# Altium project Microcontroller_sch_v22.PrjPcb
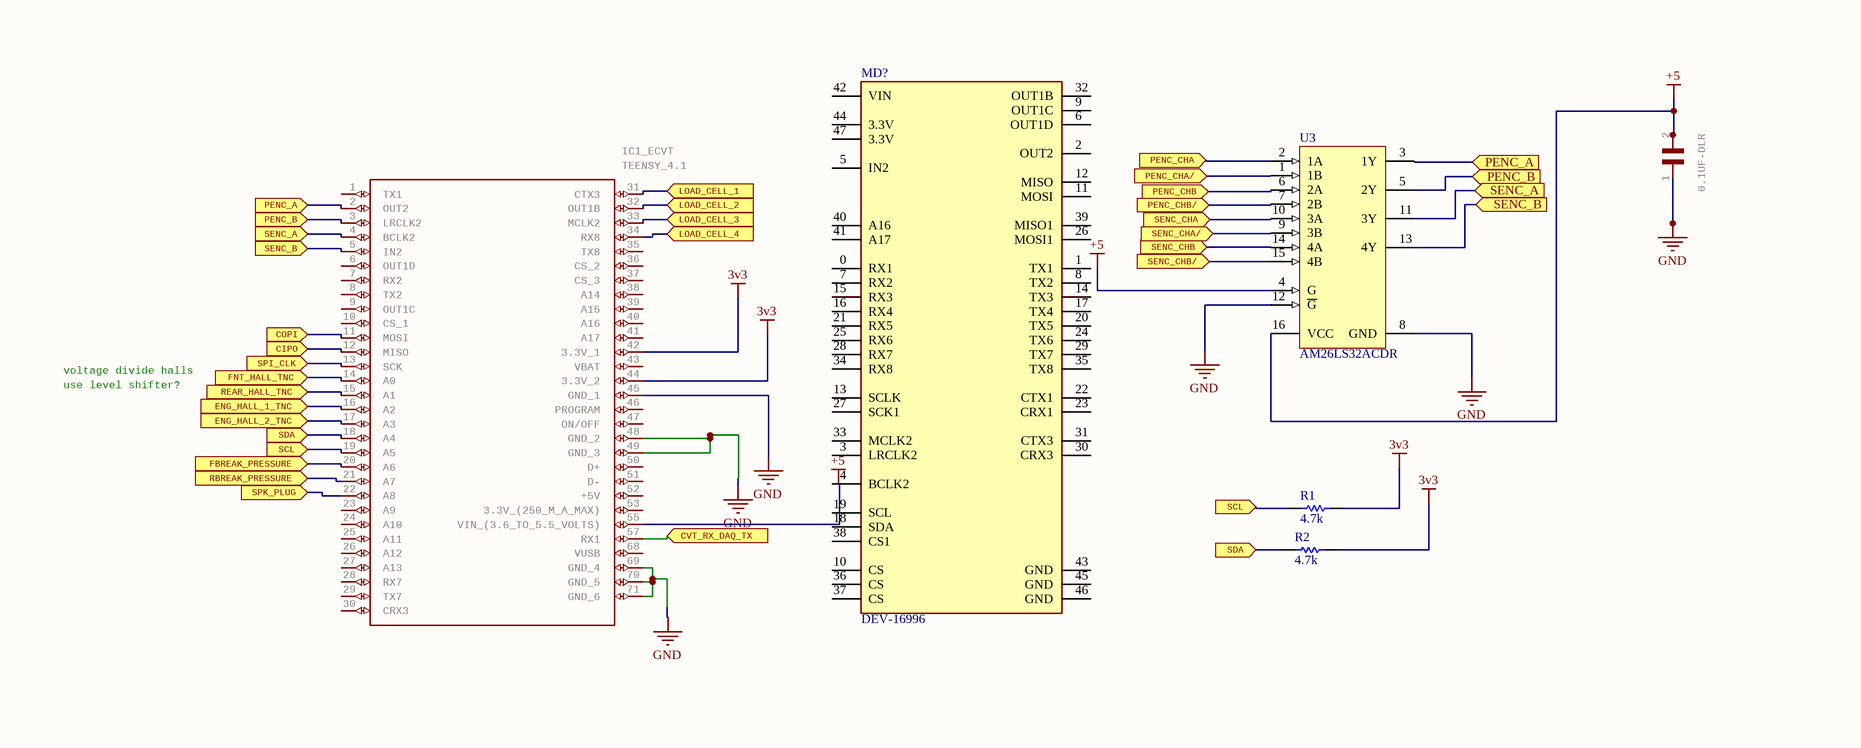
[diagram p0: Microcontroller_sch_v22_0.SchDoc]
5 sheets, 35 parts. Net scope: flat (ports and power ports of the same name join across sheets).
Board file: MicrocontrollerPCB.PcbDoc
Sheets:
  Microcontroller_sch_v22_0.SchDoc
  Microcontroller_sch_v22_1.SchDoc
  Microcontroller_sch_v22_2.SchDoc
  Microcontroller_sch_v22_3.SchDoc
  Microcontroller_sch_v22_4.SchDoc

## Sheet Microcontroller_sch_v22_0.SchDoc
size 326 x 130 mm; Origin: Eagle

### Parts
(Parts that share a designator on the sheet are numbered #1, #2 ... from top to bottom, then left to right.)
0.1UF-DLR  08055C104KAT4A  [RESC2012X60N]  (value not drawn)
IC1_ECVT  TEENSY_4.1  [TEENSY41]
MD?#1  DEV-16996  [FP-DEV-16996-MFG]
R1  4.7k  [RESC2013X50X30LL20T20]
R2  4.7k  [RESC2013X50X30LL20T20]
U3  AM26LS32ACDR  [D0016A_M]

### Ports
CIPO (in, see Microcontroller_sch_v22_1[1B], Microcontroller_sch_v22_1[5C], Microcontroller_sch_v22_4[3C], Microcontroller_sch_v22_4[4C]), COPI (in, see Microcontroller_sch_v22_1[1B], Microcontroller_sch_v22_1[5C], Microcontroller_sch_v22_4[2C], Microcontroller_sch_v22_4[4C]), CVT_RX_DAQ_TX (in, see Microcontroller_sch_v22_1[0A], Microcontroller_sch_v22_2[2C]), ENG_HALL_1_TNC (in, see Microcontroller_sch_v22_1[0C], Microcontroller_sch_v22_3[5B]), ENG_HALL_2_TNC (in, see Microcontroller_sch_v22_1[0C], Microcontroller_sch_v22_3[6B]), FBREAK_PRESSURE (in, see Microcontroller_sch_v22_1[0C], Microcontroller_sch_v22_2[2D]), FNT_HALL_TNC (in, see Microcontroller_sch_v22_1[0B], Microcontroller_sch_v22_3[3B]), LOAD_CELL_1 (in, see Microcontroller_sch_v22_2[4E]), LOAD_CELL_2 (in, see Microcontroller_sch_v22_2[4F]), LOAD_CELL_3 (in, see Microcontroller_sch_v22_2[4F]), LOAD_CELL_4 (in, see Microcontroller_sch_v22_2[4F]), PENC_A (in, see Microcontroller_sch_v22_0[1B]), PENC_A (in, see Microcontroller_sch_v22_0[5A]), PENC_B (in, see Microcontroller_sch_v22_0[1B]), PENC_B (in, see Microcontroller_sch_v22_0[5A]), PENC_CHA (in, see Microcontroller_sch_v22_2[2E]), PENC_CHA/ (in, see Microcontroller_sch_v22_2[2E]), PENC_CHB (in, see Microcontroller_sch_v22_2[2E]), PENC_CHB/ (in, see Microcontroller_sch_v22_2[2F]), RBREAK_PRESSURE (in, see Microcontroller_sch_v22_1[0C], Microcontroller_sch_v22_2[2D]), REAR_HALL_TNC (in, see Microcontroller_sch_v22_1[0B], Microcontroller_sch_v22_3[4B]), SCL (in, see Microcontroller_sch_v22_0[1C], Microcontroller_sch_v22_1[1C], Microcontroller_sch_v22_2[2D]), SCL (in, see Microcontroller_sch_v22_0[4C], Microcontroller_sch_v22_1[1C], Microcontroller_sch_v22_2[2D]), SDA (in, see Microcontroller_sch_v22_0[1C], Microcontroller_sch_v22_1[1C], Microcontroller_sch_v22_2[2C]), SDA (in, see Microcontroller_sch_v22_0[4C], Microcontroller_sch_v22_1[1C], Microcontroller_sch_v22_2[2C]), SENC_A (in, see Microcontroller_sch_v22_0[1B]), SENC_A (in, see Microcontroller_sch_v22_0[5B]), SENC_B (in, see Microcontroller_sch_v22_0[1B]), SENC_B (in, see Microcontroller_sch_v22_0[5B]), SENC_CHA (in, see Microcontroller_sch_v22_2[4B]), SENC_CHA/ (in, see Microcontroller_sch_v22_2[4B]), SENC_CHB (in, see Microcontroller_sch_v22_2[2F]), SENC_CHB/ (in, see Microcontroller_sch_v22_2[2F]), SPI_CLK (in, see Microcontroller_sch_v22_1[0B], Microcontroller_sch_v22_1[4C], Microcontroller_sch_v22_2[4B], Microcontroller_sch_v22_4[2C], Microcontroller_sch_v22_4[4C]), SPK_PLUG (in, see Microcontroller_sch_v22_1[0C], Microcontroller_sch_v22_2[2D])

### Nets
3v3: IC1_ECVT.42(3.3V_1) IC1_ECVT.44(3.3V_2) R1.2 R2.2
+5: 0.1UF-DLR.2 IC1_ECVT.55(VIN_(3.6_TO_5.5_VOLTS)) U3.4(G) U3.16(VCC)
GND: 0.1UF-DLR.1 IC1_ECVT.45(GND_1) IC1_ECVT.48(GND_2) IC1_ECVT.49(GND_3) IC1_ECVT.69(GND_4) IC1_ECVT.70(GND_5) IC1_ECVT.71(GND_6) U3.8(GND) U3.12(~{G})
NetIC1_ECVT_2: IC1_ECVT.2(OUT2) U3.3(1Y) ; port PENC_A
NetIC1_ECVT_3: IC1_ECVT.3(LRCLK2) U3.5(2Y) ; port PENC_B
NetIC1_ECVT_4: IC1_ECVT.4(BCLK2) U3.11(3Y) ; port SENC_A
NetIC1_ECVT_5: IC1_ECVT.5(IN2) U3.13(4Y) ; port SENC_B
NetIC1_ECVT_11: IC1_ECVT.11(MOSI) ; port COPI
NetIC1_ECVT_12: IC1_ECVT.12(MISO) ; port CIPO
NetIC1_ECVT_13: IC1_ECVT.13(SCK) ; port SPI_CLK
NetIC1_ECVT_14: IC1_ECVT.14(A0) ; port FNT_HALL_TNC
NetIC1_ECVT_15: IC1_ECVT.15(A1) ; port REAR_HALL_TNC
NetIC1_ECVT_16: IC1_ECVT.16(A2) ; port ENG_HALL_1_TNC
NetIC1_ECVT_17: IC1_ECVT.17(A3) ; port ENG_HALL_2_TNC
NetIC1_ECVT_18: IC1_ECVT.18(A4) R2.1 ; port SDA
NetIC1_ECVT_19: IC1_ECVT.19(A5) R1.1 ; port SCL
NetIC1_ECVT_20: IC1_ECVT.20(A6) ; port FBREAK_PRESSURE
NetIC1_ECVT_21: IC1_ECVT.21(A7) ; port RBREAK_PRESSURE
NetIC1_ECVT_22: IC1_ECVT.22(A8) ; port SPK_PLUG
NetIC1_ECVT_31: IC1_ECVT.31(CTX3) ; port LOAD_CELL_1
NetIC1_ECVT_32: IC1_ECVT.32(OUT1B) ; port LOAD_CELL_2
NetIC1_ECVT_33: IC1_ECVT.33(MCLK2) ; port LOAD_CELL_3
NetIC1_ECVT_34: IC1_ECVT.34(RX8) ; port LOAD_CELL_4
NetIC1_ECVT_57: IC1_ECVT.57(RX1) ; port CVT_RX_DAQ_TX
NetJ2_C1: U3.2(1A) ; port PENC_CHA
NetJ2_C2: U3.1(1B) ; port PENC_CHA/
NetJ2_C3: U3.6(2A) ; port PENC_CHB
NetJ2_C4: U3.7(2B) ; port PENC_CHB/
NetJ2_C5: U3.14(4A) ; port SENC_CHB
NetJ2_C6: U3.15(4B) ; port SENC_CHB/
NetJ2_C7: U3.9(3B) ; port SENC_CHA/
NetJ2_C8: U3.10(3A) ; port SENC_CHA

Not connected (* = marked no-connect by the designer): IC1_ECVT 1(TX1) 6(OUT1D) 7(RX2) 8(TX2) 9(OUT1C) 10(CS_1) 23(A9) 24(A10) 25(A11) 26(A12) 27(A13) 28(RX7) 29(TX7) 30(CRX3) 35(TX8) 36(CS_2) 37(CS_3) 38(A14) 39(A15) 40(A16) 41(A17) 43(VBAT) 46(PROGRAM) 47(ON/OFF) 50(D+) 51(D-) 52(+5V) 53(3.3V_(250_M_A_MAX)) 68(VUSB); MD?#1 0(RX1) 1(TX1) 2(OUT2) 3(LRCLK2) 4(BCLK2) 5(IN2) 6(OUT1D) 7(RX2) 8(TX2) 9(OUT1C) 10(CS) 11(MOSI) 12(MISO) 13(SCLK) 14(TX3) 15(RX3) 16(RX4) 17(TX4) 18(SDA) 19(SCL) 20(TX5) 21(RX5) 22(CTX1) 23(CRX1) 24(TX6) 25(RX6) 26(MOSI1) 27(SCK1) 28(RX7) 29(TX7) 30(CRX3) 31(CTX3) 32(OUT1B) 33(MCLK2) 34(RX8) 35(TX8) 36(CS) 37(CS) 38(CS1) 39(MISO1) 40(A16) 41(A17) 42(VIN) 43(GND) 44(3.3V) 45(GND) 46(GND) 47(3.3V)

### Notes on the sheet
- voltage divide halls
- use level shifter?

### Library data of the parts
0.1UF-DLR = 08055C104KAT4A: .1UF 50V 10% 0805; GateName_1: G$1; MF: AVX; SymbolName_1: 08055C104KAT4A; LibraryName: 08055C104KAT4A; DeviceSetName: 08055C104KAT4A; DIGI-KEY_PART_NUMBER: 478-10836-1-ND; MP: 08055C104KAT4A; PACKAGE: 2012 AVX; PURCHASE-URL: https://pricing.snapeda.com/search/part/08055C104KAT4A/?ref=eda
IC1_ECVT = TEENSY_4.1: Teensy 4.1 Development Board   Source:  Datasheet; MANUFACTURER_NAME: PJRC; GateName_1: G$1; SymbolName_1: TEENSY_4.1; LibraryName: TEENSY_4.1; DeviceSetName: TEENSY_4.1; ARROW_PART_NUMBER: ARROW_PART_NUMBER; ARROW_PRICE-STOCK: ARROW_PRICE-STOCK; HEIGHT: mm; MANUFACTURER_PART_NUMBER: TEENSY 4.1; MOUSER_PART_NUMBER: MOUSER_PART_NUMBER; MOUSER_PRICE-STOCK: MOUSER_PRICE-STOCK; MOUSER_TESTING_PART_NUMBER: MOUSER_TESTING_PART_NUMBER; MOUSER_TESTING_PRICE-STOCK: MOUSER_TESTING_PRICE-STOCK
MD?#1 = CMP-157412-000001-1: TEENSY 4.1 (HEADERS)
R1 R2 = CMP-2001-04896-1: Manufacturer: Vishay Dale; Part Number: CRCW08050000Z0EA
U3 = CMP-0310-00258-2: Quadruple Differential Line Receiver, 0 TX / 4 RX, 0 to 70 degC, 16-Pin SOIC (D), Green (RoHS & no Sb/Br); Manufacturer: Texas Instruments; Rating: Catalog; ICC(Max)(mA): 70; SubFamily: RS-422; Receivers Per Package: 4; ComponentLink1Description: Datasheet; # of TX/RX: 0 TX / 4 RX; Mounting Technology: Surface Mount; Code_JEDEC: MS-012AC; DatasheetVersion: SLLS115E; ComponentLink2Description: Package Specification; Eco-Plan: Green (RoHS & no Sb/Br); PackageDescription: 16-Pin Plastic Small Outline Integrated Circuit, 9.9 x 3.9 mm, Pitch 1.27 mm Pitch; ComponentLink2URL: http://www.ti.com/litv/pdf/mpds178g; PartNumber: AM26LS32ACDR; PackageReference: D0016A; PackageVersion: revM, Jun-2011; ComponentLink1URL: http://www.ti.com/general/docs/lit/getliterature.tsp?genericPartNumber=AM26LS32AC&fileType=pdf

## Sheet Microcontroller_sch_v22_1.SchDoc
size 228 x 123 mm; Origin: Eagle
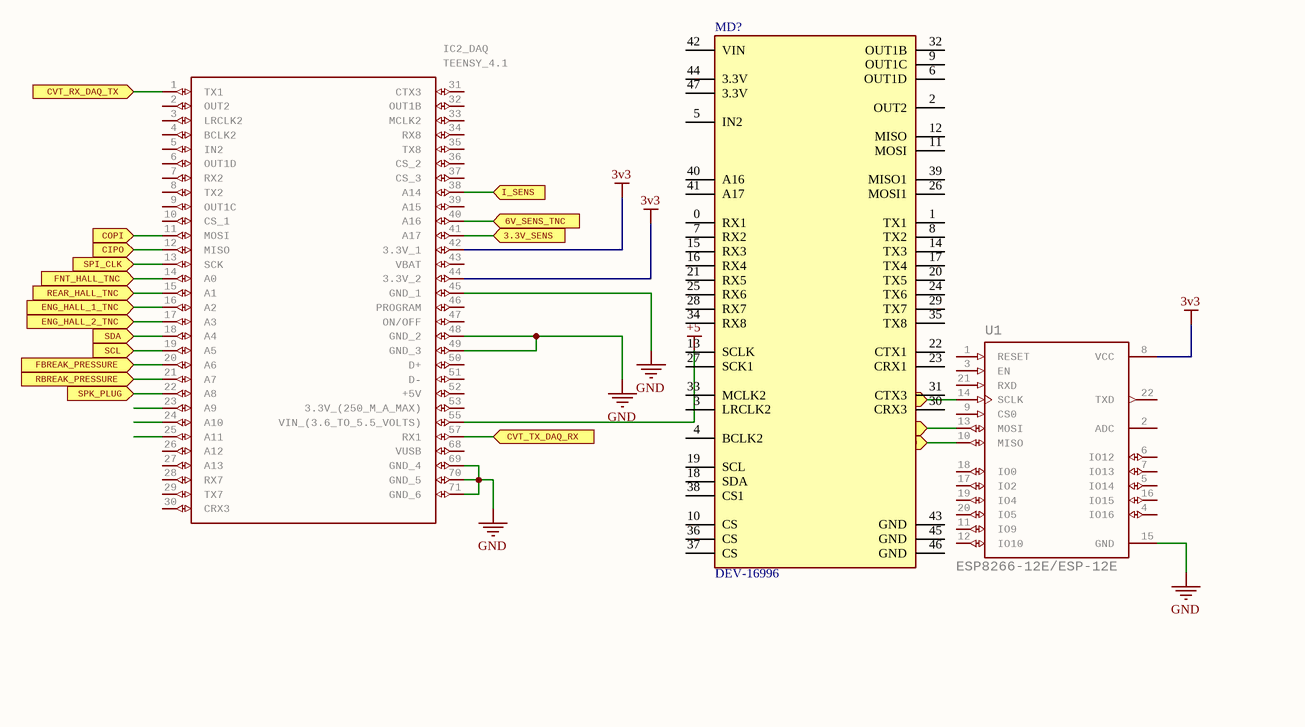
[diagram p1: Microcontroller_sch_v22_1.SchDoc]

### Parts
(Parts that share a designator on the sheet are numbered #1, #2 ... from top to bottom, then left to right.)
IC2_DAQ  TEENSY_4.1  [TEENSY41]
MD?#2  DEV-16996  [FP-DEV-16996-MFG]
U1  ESP8266-12E/ESP-12E  [XCVR_ESP8266-12E$ESP-12E]

### Ports
3.3V_SENS (in, see Microcontroller_sch_v22_2[2E]), 6V_SENS_TNC (in, see Microcontroller_sch_v22_3[2B]), CIPO (in, see Microcontroller_sch_v22_0[1B], Microcontroller_sch_v22_1[1B], Microcontroller_sch_v22_4[3C], Microcontroller_sch_v22_4[4C]), CIPO (in, see Microcontroller_sch_v22_0[1B], Microcontroller_sch_v22_1[5C], Microcontroller_sch_v22_4[3C], Microcontroller_sch_v22_4[4C]), COPI (in, see Microcontroller_sch_v22_0[1B], Microcontroller_sch_v22_1[1B], Microcontroller_sch_v22_4[2C], Microcontroller_sch_v22_4[4C]), COPI (in, see Microcontroller_sch_v22_0[1B], Microcontroller_sch_v22_1[5C], Microcontroller_sch_v22_4[2C], Microcontroller_sch_v22_4[4C]), CVT_RX_DAQ_TX (in, see Microcontroller_sch_v22_0[3C], Microcontroller_sch_v22_2[2C]), CVT_TX_DAQ_RX (in, see Microcontroller_sch_v22_0[1B], Microcontroller_sch_v22_2[2C]), ENG_HALL_1_TNC (in, see Microcontroller_sch_v22_0[1C], Microcontroller_sch_v22_3[5B]), ENG_HALL_2_TNC (in, see Microcontroller_sch_v22_0[1C], Microcontroller_sch_v22_3[6B]), FBREAK_PRESSURE (in, see Microcontroller_sch_v22_0[1C], Microcontroller_sch_v22_2[2D]), FNT_HALL_TNC (in, see Microcontroller_sch_v22_0[1C], Microcontroller_sch_v22_3[3B]), I_SENS (in, see Microcontroller_sch_v22_2[2E]), RBREAK_PRESSURE (in, see Microcontroller_sch_v22_0[1C], Microcontroller_sch_v22_2[2D]), REAR_HALL_TNC (in, see Microcontroller_sch_v22_0[1C], Microcontroller_sch_v22_3[4B]), SCL (in, see Microcontroller_sch_v22_0[1C], Microcontroller_sch_v22_0[4C], Microcontroller_sch_v22_2[2D]), SDA (in, see Microcontroller_sch_v22_0[1C], Microcontroller_sch_v22_0[4C], Microcontroller_sch_v22_2[2C]), SPI_CLK (in), SPI_CLK (in, see Microcontroller_sch_v22_0[1B], Microcontroller_sch_v22_1[4C], Microcontroller_sch_v22_2[4B], Microcontroller_sch_v22_4[2C], Microcontroller_sch_v22_4[4C]), SPK_PLUG (in, see Microcontroller_sch_v22_0[1C], Microcontroller_sch_v22_2[2D])

### Nets
3v3: IC2_DAQ.42(3.3V_1) IC2_DAQ.44(3.3V_2) U1.8(VCC)
+5: IC2_DAQ.55(VIN_(3.6_TO_5.5_VOLTS))
GND: IC2_DAQ.45(GND_1) IC2_DAQ.48(GND_2) IC2_DAQ.49(GND_3) IC2_DAQ.69(GND_4) IC2_DAQ.70(GND_5) IC2_DAQ.71(GND_6) U1.15(GND)
NetIC1_ECVT_11: IC2_DAQ.11(MOSI) U1.13(MOSI) ; port COPI
NetIC1_ECVT_12: IC2_DAQ.12(MISO) U1.10(MISO) ; port CIPO
NetIC1_ECVT_13: IC2_DAQ.13(SCK) U1.14(SCLK) ; port SPI_CLK
NetIC1_ECVT_14: IC2_DAQ.14(A0) ; port FNT_HALL_TNC
NetIC1_ECVT_15: IC2_DAQ.15(A1) ; port REAR_HALL_TNC
NetIC1_ECVT_16: IC2_DAQ.16(A2) ; port ENG_HALL_1_TNC
NetIC1_ECVT_17: IC2_DAQ.17(A3) ; port ENG_HALL_2_TNC
NetIC1_ECVT_18: IC2_DAQ.18(A4) ; port SDA
NetIC1_ECVT_19: IC2_DAQ.19(A5) ; port SCL
NetIC1_ECVT_20: IC2_DAQ.20(A6) ; port FBREAK_PRESSURE
NetIC1_ECVT_21: IC2_DAQ.21(A7) ; port RBREAK_PRESSURE
NetIC1_ECVT_22: IC2_DAQ.22(A8) ; port SPK_PLUG
NetIC1_ECVT_57: IC2_DAQ.1(TX1) ; port CVT_RX_DAQ_TX
NetIC2_DAQ_38: IC2_DAQ.38(A14) ; port I_SENS
NetIC2_DAQ_40: IC2_DAQ.40(A16) ; port 6V_SENS_TNC
NetIC2_DAQ_41: IC2_DAQ.41(A17) ; port 3.3V_SENS
NetIC2_DAQ_57: IC2_DAQ.57(RX1) ; port CVT_TX_DAQ_RX

Not connected (* = marked no-connect by the designer): IC2_DAQ 2(OUT2) 3(LRCLK2) 4(BCLK2) 5(IN2) 6(OUT1D) 7(RX2) 8(TX2) 9(OUT1C) 10(CS_1) 23(A9) 24(A10) 25(A11) 26(A12) 27(A13) 28(RX7) 29(TX7) 30(CRX3) 31(CTX3) 32(OUT1B) 33(MCLK2) 34(RX8) 35(TX8) 36(CS_2) 37(CS_3) 39(A15) 43(VBAT) 46(PROGRAM) 47(ON/OFF) 50(D+) 51(D-) 52(+5V) 53(3.3V_(250_M_A_MAX)) 68(VUSB); MD?#2 0(RX1) 1(TX1) 2(OUT2) 3(LRCLK2) 4(BCLK2) 5(IN2) 6(OUT1D) 7(RX2) 8(TX2) 9(OUT1C) 10(CS) 11(MOSI) 12(MISO) 13(SCLK) 14(TX3) 15(RX3) 16(RX4) 17(TX4) 18(SDA) 19(SCL) 20(TX5) 21(RX5) 22(CTX1) 23(CRX1) 24(TX6) 25(RX6) 26(MOSI1) 27(SCK1) 28(RX7) 29(TX7) 30(CRX3) 31(CTX3) 32(OUT1B) 33(MCLK2) 34(RX8) 35(TX8) 36(CS) 37(CS) 38(CS1) 39(MISO1) 40(A16) 41(A17) 42(VIN) 43(GND) 44(3.3V) 45(GND) 46(GND) 47(3.3V); U1 1(RESET) 2(ADC) 3(EN) 4(IO16) 5(IO14) 6(IO12) 7(IO13) 9(CS0) 11(IO9) 12(IO10) 16(IO15) 17(IO2) 18(IO0) 19(IO4) 20(IO5) 21(RXD) 22(TXD)

### Library data of the parts
IC2_DAQ = TEENSY_4.1: as IC1_ECVT on sheet Microcontroller_sch_v22_0; SymbolName_1: TEENSY_4.1; LibraryName: TEENSY_4.1; DeviceSetName: TEENSY_4.1; ARROW_PART_NUMBER: ARROW_PART_NUMBER; ARROW_PRICE-STOCK: ARROW_PRICE-STOCK; HEIGHT: mm; MANUFACTURER_PART_NUMBER: TEENSY 4.1; MOUSER_PART_NUMBER: MOUSER_PART_NUMBER; MOUSER_PRICE-STOCK: MOUSER_PRICE-STOCK; MOUSER_TESTING_PART_NUMBER: MOUSER_TESTING_PART_NUMBER; MOUSER_TESTING_PRICE-STOCK: MOUSER_TESTING_PRICE-STOCK
MD?#2 = CMP-157412-000001-1: TEENSY 4.1 (HEADERS)
U1 = ESP8266-12E/ESP-12E: ESP-12E WiFi Module Check availability; GateName_1: G$1; MF: AI-Thinker; SymbolName_1: ESP8266-12E/ESP-12E; LibraryName: ESP8266-12E_ESP-12E; DeviceSetName: ESP8266-12E/ESP-12E; AVAILABILITY: Not in stock; MP: ESP8266-12E/ESP-12E; PACKAGE: None; PRICE: None

## Sheet Microcontroller_sch_v22_2.SchDoc
size 104 x 111 mm; Origin: Eagle
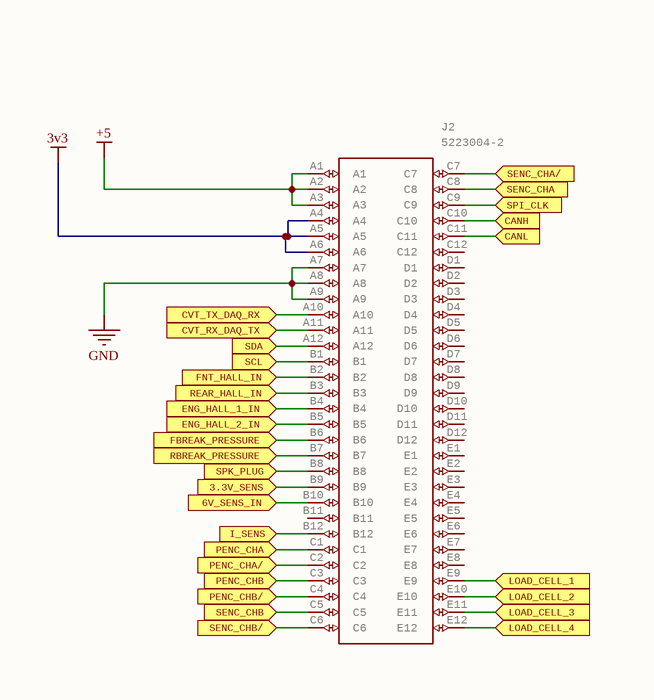
[diagram p2: Microcontroller_sch_v22_2.SchDoc]

### Parts
J2  5223004-2  [52230042]

### Ports
3.3V_SENS (in, see Microcontroller_sch_v22_1[2B]), 6V_SENS_IN (in, see Microcontroller_sch_v22_3[1A]), CANH (in, see Microcontroller_sch_v22_4[1B]), CANL (in, see Microcontroller_sch_v22_4[1B]), CVT_RX_DAQ_TX (in, see Microcontroller_sch_v22_0[3C], Microcontroller_sch_v22_1[0A]), CVT_TX_DAQ_RX (in, see Microcontroller_sch_v22_0[1B], Microcontroller_sch_v22_1[2C]), ENG_HALL_1_IN (in, see Microcontroller_sch_v22_3[4A]), ENG_HALL_2_IN (in, see Microcontroller_sch_v22_3[5A]), FBREAK_PRESSURE (in, see Microcontroller_sch_v22_0[1C], Microcontroller_sch_v22_1[0C]), FNT_HALL_IN (in, see Microcontroller_sch_v22_3[2A]), I_SENS (in, see Microcontroller_sch_v22_1[2B]), LOAD_CELL_1 (in, see Microcontroller_sch_v22_0[3B]), LOAD_CELL_2 (in, see Microcontroller_sch_v22_0[3B]), LOAD_CELL_3 (in, see Microcontroller_sch_v22_0[3B]), LOAD_CELL_4 (in, see Microcontroller_sch_v22_0[3B]), PENC_CHA (in, see Microcontroller_sch_v22_0[4A]), PENC_CHA/ (in, see Microcontroller_sch_v22_0[4A]), PENC_CHB (in, see Microcontroller_sch_v22_0[4B]), PENC_CHB/ (in, see Microcontroller_sch_v22_0[4B]), RBREAK_PRESSURE (in, see Microcontroller_sch_v22_0[1C], Microcontroller_sch_v22_1[0C]), REAR_HALL_IN (in, see Microcontroller_sch_v22_3[3A]), SCL (in, see Microcontroller_sch_v22_0[1C], Microcontroller_sch_v22_0[4C], Microcontroller_sch_v22_1[1C]), SDA (in, see Microcontroller_sch_v22_0[1C], Microcontroller_sch_v22_0[4C], Microcontroller_sch_v22_1[1C]), SENC_CHA (in, see Microcontroller_sch_v22_0[4B]), SENC_CHA/ (in, see Microcontroller_sch_v22_0[4B]), SENC_CHB (in, see Microcontroller_sch_v22_0[4B]), SENC_CHB/ (in, see Microcontroller_sch_v22_0[4B]), SPI_CLK (in, see Microcontroller_sch_v22_0[1B], Microcontroller_sch_v22_1[0B], Microcontroller_sch_v22_1[4C], Microcontroller_sch_v22_4[2C], Microcontroller_sch_v22_4[4C]), SPK_PLUG (in, see Microcontroller_sch_v22_0[1C], Microcontroller_sch_v22_1[0C])

### Nets
3v3: J2.A4 J2.A5 J2.A6
+5: J2.A1 J2.A2 J2.A3
GND: J2.A7 J2.A8 J2.A9
NetIC1_ECVT_13: J2.C9 ; port SPI_CLK
NetIC1_ECVT_18: J2.A12 ; port SDA
NetIC1_ECVT_19: J2.B1 ; port SCL
NetIC1_ECVT_20: J2.B6 ; port FBREAK_PRESSURE
NetIC1_ECVT_21: J2.B7 ; port RBREAK_PRESSURE
NetIC1_ECVT_22: J2.B8 ; port SPK_PLUG
NetIC1_ECVT_31: J2.E9 ; port LOAD_CELL_1
NetIC1_ECVT_32: J2.E10 ; port LOAD_CELL_2
NetIC1_ECVT_33: J2.E11 ; port LOAD_CELL_3
NetIC1_ECVT_34: J2.E12 ; port LOAD_CELL_4
NetIC1_ECVT_57: J2.A11 ; port CVT_RX_DAQ_TX
NetIC2_DAQ_38: J2.B12 ; port I_SENS
NetIC2_DAQ_41: J2.B9 ; port 3.3V_SENS
NetIC2_DAQ_57: J2.A10 ; port CVT_TX_DAQ_RX
NetJ2_B2: J2.B2 ; port FNT_HALL_IN
NetJ2_B3: J2.B3 ; port REAR_HALL_IN
NetJ2_B4: J2.B4 ; port ENG_HALL_1_IN
NetJ2_B5: J2.B5 ; port ENG_HALL_2_IN
NetJ2_B10: J2.B10 ; port 6V_SENS_IN
NetJ2_C1: J2.C1 ; port PENC_CHA
NetJ2_C2: J2.C2 ; port PENC_CHA/
NetJ2_C3: J2.C3 ; port PENC_CHB
NetJ2_C4: J2.C4 ; port PENC_CHB/
NetJ2_C5: J2.C5 ; port SENC_CHB
NetJ2_C6: J2.C6 ; port SENC_CHB/
NetJ2_C7: J2.C7 ; port SENC_CHA/
NetJ2_C8: J2.C8 ; port SENC_CHA
NetJ2_C10: J2.C10 ; port CANH
NetJ2_C11: J2.C11 ; port CANL

Not connected (* = marked no-connect by the designer): J2 B11 C12 D1 D2 D3 D4 D5 D6 D7 D8 D9 D10 D11 D12 E1 E2 E3 E4 E5 E6 E7 E8

### Library data of the parts
J2 = 5223004-2: Conn Backplane RCP 60 POS 2mm Solder RA Thru-Hole Tube   Source:  Datasheet; MANUFACTURER_NAME: TE Connectivity; GateName_1: G$1; SymbolName_1: 5223004-2; LibraryName: SamacSys_Parts; DeviceSetName: 5223004-2; HEIGHT: 14mm; MANUFACTURER_PART_NUMBER: 5223004-2; MOUSER_PART_NUMBER: 571-5223004-2; MOUSER_PRICE-STOCK: https://www.mouser.co.uk/ProductDetail/TE-Connectivity/5223004-2?qs=oNRo%252BTjlpTO6tP0xSX%252BI3w%3D%3D

## Sheet Microcontroller_sch_v22_3.SchDoc
size 174 x 75 mm; Origin: Eagle
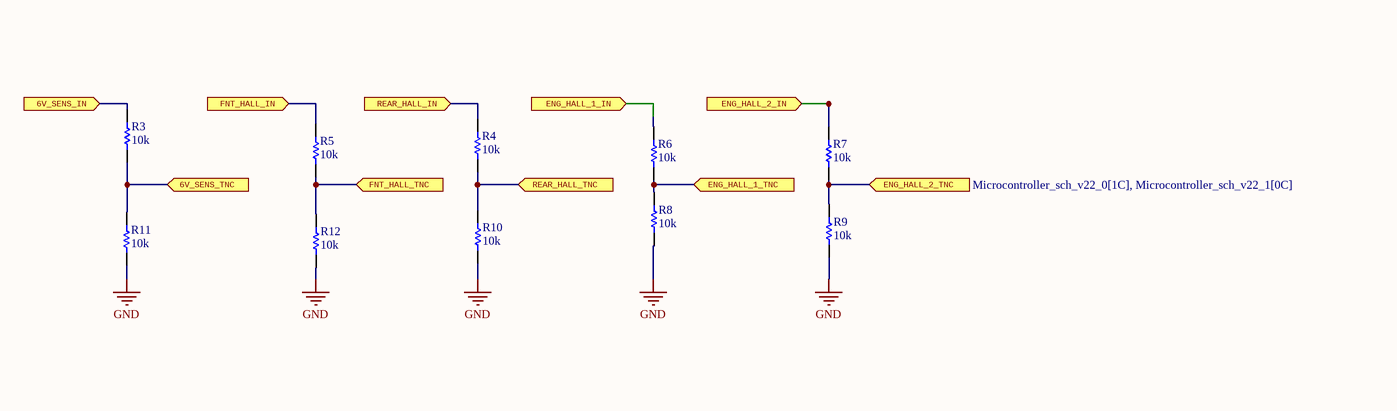
[diagram p3: Microcontroller_sch_v22_3.SchDoc]

### Parts
R3  10k  [RESC2013X50X30LL20T20]
R4  10k  [RESC2013X50X30LL20T20]
R5  10k  [RESC2013X50X30LL20T20]
R6  10k  [RESC2013X50X30LL20T20]
R7  10k  [RESC2013X50X30LL20T20]
R8  10k  [RESC2013X50X30LL20T20]
R9  10k  [RESC2013X50X30LL20T20]
R10  10k  [RESC2013X50X30LL20T20]
R11  10k  [RESC2013X50X30LL20T20]
R12  10k  [RESC2013X50X30LL20T20]

### Ports
6V_SENS_IN (in, see Microcontroller_sch_v22_2[2E]), 6V_SENS_TNC (in, see Microcontroller_sch_v22_1[2B]), ENG_HALL_1_IN (in, see Microcontroller_sch_v22_2[2D]), ENG_HALL_1_TNC (in, see Microcontroller_sch_v22_0[1C], Microcontroller_sch_v22_1[0C]), ENG_HALL_2_IN (in, see Microcontroller_sch_v22_2[2D]), ENG_HALL_2_TNC (in, see Microcontroller_sch_v22_0[1C], Microcontroller_sch_v22_1[0C]), FNT_HALL_IN (in, see Microcontroller_sch_v22_2[2D]), FNT_HALL_TNC (in, see Microcontroller_sch_v22_0[1C], Microcontroller_sch_v22_1[0B]), REAR_HALL_IN (in, see Microcontroller_sch_v22_2[2D]), REAR_HALL_TNC (in, see Microcontroller_sch_v22_0[1C], Microcontroller_sch_v22_1[0B])

### Nets
GND: R8.1 R9.1 R10.1 R11.1 R12.1
NetIC1_ECVT_14: R5.1 R12.2 ; port FNT_HALL_TNC
NetIC1_ECVT_15: R4.1 R10.2 ; port REAR_HALL_TNC
NetIC1_ECVT_16: R6.1 R8.2 ; port ENG_HALL_1_TNC
NetIC1_ECVT_17: R7.1 R9.2 ; port ENG_HALL_2_TNC
NetIC2_DAQ_40: R3.1 R11.2 ; port 6V_SENS_TNC
NetJ2_B2: R5.2 ; port FNT_HALL_IN
NetJ2_B3: R4.2 ; port REAR_HALL_IN
NetJ2_B4: R6.2 ; port ENG_HALL_1_IN
NetJ2_B5: R7.2 ; port ENG_HALL_2_IN
NetJ2_B10: R3.2 ; port 6V_SENS_IN

### Library data of the parts
R3-R12 = CMP-2001-04896-1: as R1 on sheet Microcontroller_sch_v22_0

## Sheet Microcontroller_sch_v22_4.SchDoc
size 286 x 127 mm; Origin: Eagle
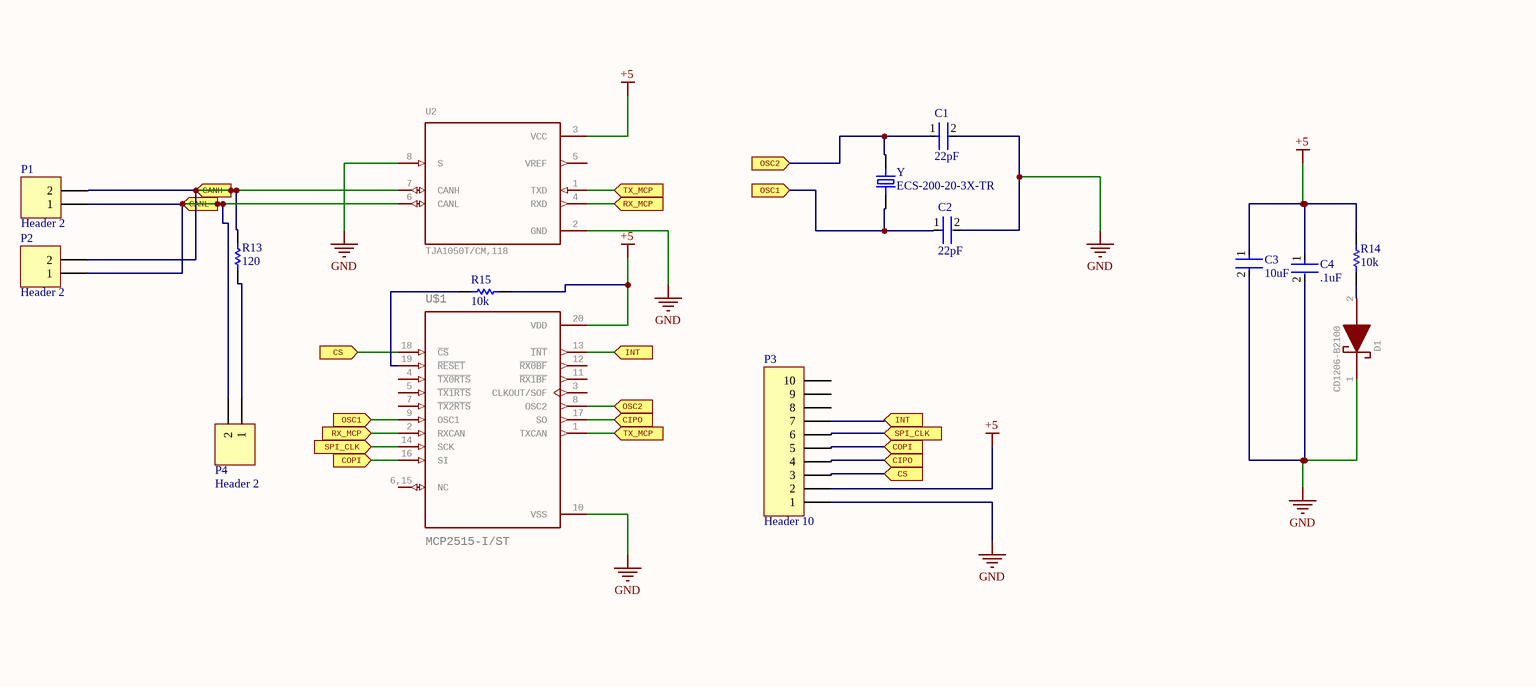
[diagram p4: Microcontroller_sch_v22_4.SchDoc]

### Parts
C1  22pF  [FP-GRM21B-0_15-IPC_C]
C2  22pF  [FP-GRM21B-0_15-IPC_C]
C3  10uF  [FP-GRM21B-0_15-IPC_C]
C4  .1uF  [FP-GRM21B-0_15-IPC_C]
D1  CD1206-B2100  [DIOC3419X116N]
P1  Header 2  [HDR1X2]
P2  Header 2  [HDR1X2]
P3  Header 10  [HDR1X10]
P4  Header 2  [HDR1X2]
R13  120  [RESC2013X50X30LL20T20]
R14  10k  [RESC2013X50X30LL20T20]
R15  10k  [RESC2013X50X30LL20T20]
U2  TJA1050T/CM,118  [SOIC127P600X175-8N]
U$1  MCP2515-I/ST  [SOP65P640X110-20N]
Y  ECS-200-20-3X-TR  [XTAL_ECS-200-20-3X-TR]

### Ports
CANH (in, see Microcontroller_sch_v22_2[4B]), CANL (in, see Microcontroller_sch_v22_2[4B]), CIPO (in, see Microcontroller_sch_v22_0[1B], Microcontroller_sch_v22_1[1B], Microcontroller_sch_v22_1[5C], Microcontroller_sch_v22_4[3C]), CIPO (in, see Microcontroller_sch_v22_0[1B], Microcontroller_sch_v22_1[1B], Microcontroller_sch_v22_1[5C], Microcontroller_sch_v22_4[4C]), COPI (in, see Microcontroller_sch_v22_0[1B], Microcontroller_sch_v22_1[1B], Microcontroller_sch_v22_1[5C], Microcontroller_sch_v22_4[2C]), COPI (in, see Microcontroller_sch_v22_0[1B], Microcontroller_sch_v22_1[1B], Microcontroller_sch_v22_1[5C], Microcontroller_sch_v22_4[4C]), CS (in, see Microcontroller_sch_v22_4[2C]), CS (in, see Microcontroller_sch_v22_4[4C]), INT (in, see Microcontroller_sch_v22_4[3C]), INT (in, see Microcontroller_sch_v22_4[4C]), OSC1 (in, see Microcontroller_sch_v22_4[2C]), OSC1 (in, see Microcontroller_sch_v22_4[3B]), OSC2 (in, see Microcontroller_sch_v22_4[3A]), OSC2 (in, see Microcontroller_sch_v22_4[3C]), RX_MCP (in, see Microcontroller_sch_v22_4[2C]), RX_MCP (in, see Microcontroller_sch_v22_4[3B]), SPI_CLK (in, see Microcontroller_sch_v22_0[1B], Microcontroller_sch_v22_1[0B], Microcontroller_sch_v22_1[4C], Microcontroller_sch_v22_2[4B], Microcontroller_sch_v22_4[2C]), SPI_CLK (in, see Microcontroller_sch_v22_0[1B], Microcontroller_sch_v22_1[0B], Microcontroller_sch_v22_1[4C], Microcontroller_sch_v22_2[4B], Microcontroller_sch_v22_4[4C]), TX_MCP (in, see Microcontroller_sch_v22_4[3B]), TX_MCP (in, see Microcontroller_sch_v22_4[3C])

### Nets
+5: C3.1 C4.1 P3.2 R14.1 R15.1 U2.3(VCC) U$1.20(VDD)
GND: C1.2 C2.2 C3.2 C4.2 D1.1(K) P3.1 U2.2(GND) U2.8(S) U$1.10(VSS)
NetC1_1: C1.1 U$1.8(OSC2) Y.2 ; port OSC2
NetC2_1: C2.1 U$1.9(OSC1) Y.1 ; port OSC1
NetD1_2: D1.2(A) R14.2
NetIC1_ECVT_11: P3.5 U$1.16(SI) ; port COPI
NetIC1_ECVT_12: P3.4 U$1.17(SO) ; port CIPO
NetIC1_ECVT_13: P3.6 U$1.14(SCK) ; port SPI_CLK
NetJ2_C10: P1.2 P2.2 R13.2 U2.7(CANH) ; port CANH
NetJ2_C11: P1.1 P2.1 P4.2 U2.6(CANL) ; port CANL
NetP3_3: P3.3 U$1.18(~{CS}) ; port CS
NetP3_7: P3.7 U$1.13(~{INT}) ; port INT
NetP4_1: P4.1 R13.1
NetR15_2: R15.2 U$1.19(~{RESET})
NetU2_1: U2.1(TXD) U$1.1(TXCAN) ; port TX_MCP
NetU2_4: U2.4(RXD) U$1.2(RXCAN) ; port RX_MCP

Not connected (* = marked no-connect by the designer): P3 8 9 10; U2 5(VREF); U$1 3(CLKOUT/SOF) 4(~{TX0RTS}) 5(~{TX1RTS}) 6,15(NC) 7(~{TX2RTS}) 11(~{RX1BF}) 12(~{RX0BF})

### Library data of the parts
C1-C4 = CMP-2007-03541-2: Chip Multilayer Ceramic Capacitors for General Purpose, 0805, 10uF, X5R, 15%, 10%, 25V; Length: 2mm; Depth: 1.25mm; Termination: SMD/SMT; Voltage: 25V; Height: 1.25mm; Material: Ceramic; Thickness: 0.053inch; Radiation Hardening: No; Min Operating Temperature: -55°C; Width: 0.049inch; Package Quantity: 1; Mount: Surface Mount; Dielectric: X5R; Packaging: Tape and Reel; Capacitance: 10uF; Voltage Rating (DC): 25V; Lead Free: Lead Free; Max Operating Temperature: 85°C; Case Code (Imperial): 0805; Case/Package: 0805; Tolerance: 10%; Voltage Rating: 25V; Case Code (Metric): 2012
D1 = CD1206-B2100: Schottky Diodes & Rectifiers CHIP DIODE   Source:  Datasheet; MANUFACTURER_NAME: Bourns; GateName_1: G$1; SymbolName_1: CD1206-B2100; LibraryName: CD1206-B2100; DeviceSetName: CD1206-B2100; HEIGHT: 1.16mm; MANUFACTURER_PART_NUMBER: CD1206-B2100; MOUSER_PART_NUMBER: 652-CD1206-B2100; MOUSER_PRICE-STOCK: https://www.mouser.co.uk/ProductDetail/Bourns/CD1206-B2100?qs=VNGG2InBe5EQUAtP9HPU9g%3D%3D
P1 P2 P4 = Header 2: Header, 2-Pin; LatestRevisionDate: 17-Jul-2002; LatestRevisionNote: Re-released for DXP Platform.; Publisher: Altium Limited
P3 = Header 10: Header, 10-Pin; LatestRevisionDate: 17-Jul-2002; LatestRevisionNote: Re-released for DXP Platform.; Publisher: Altium Limited
R13-R15 = CMP-2001-04896-1: as R1 on sheet Microcontroller_sch_v22_0
U2 = TJA1050T/CM,118: 1/1 Transceiver Half CANbus 8-SO; MANUFACTURER: NXP USA; GateName_1: G$1; SymbolName_1: TJA1050T/CM,118; LibraryName: TJA1050T_CM_118; DeviceSetName: TJA1050T/CM,118; MAXIMUM_PACKAGE_HEIGHT: 1.75 mm; PARTREV: 4; STANDARD: IPC 7351B
U$1 = MCP2515-I/ST: Check availability; GateName_1: A; MF: Microchip; SymbolName_1: MCP2515-I/ST; LibraryName: MCP2515-I_ST; DeviceSetName: MCP2515-I/ST; AVAILABILITY: In Stock; MP: MCP2515-I/ST; PACKAGE: TSSOP-20 Microchip; PRICE: None; PURCHASE-URL: https://pricing.snapeda.com/search/part/MCP2515-I/ST/?ref=eda
Y = ECS-200-20-3X-TR: 20MHz Â± 30ppm Cristal 20pF 50 Ohms HC-49 / US; MF: ECS Inc.; Value: *; Digi-Key_Purchase_URL: https://www.digikey.com/product-detail/en/ecs-inc/ECS-200-20-3X-TR/XC1779CT-ND/2676643?utm_source=snapeda&utm_medium=aggregator&utm_campaign=symbol; Package: HC49/US ECS International; Digi-Key_Part_Number: XC1779CT-ND; MP: ECS-200-20-3X-TR; SnapEDA_Link: https://www.snapeda.com/parts/ECS-200-20-3X-TR/ECS%20Inc./view-part/2455740/?ref=snap

## Nets that join several sheets
3v3: Microcontroller_sch_v22_0 (IC1_ECVT.42 IC1_ECVT.44 R1.2 R2.2), Microcontroller_sch_v22_1 (IC2_DAQ.42 IC2_DAQ.44 U1.8), Microcontroller_sch_v22_2 (J2.A4 J2.A5 J2.A6)
+5: Microcontroller_sch_v22_0 (0.1UF-DLR.2 IC1_ECVT.55 U3.4 U3.16), Microcontroller_sch_v22_1 (IC2_DAQ.55), Microcontroller_sch_v22_2 (J2.A1 J2.A2 J2.A3), Microcontroller_sch_v22_4 (7 pins)
GND: Microcontroller_sch_v22_0 (9 pins), Microcontroller_sch_v22_1 (7 pins), Microcontroller_sch_v22_2 (J2.A7 J2.A8 J2.A9), Microcontroller_sch_v22_3 (5 pins), Microcontroller_sch_v22_4 (9 pins)
NetIC1_ECVT_11: Microcontroller_sch_v22_0 (IC1_ECVT.11), Microcontroller_sch_v22_1 (IC2_DAQ.11 U1.13), Microcontroller_sch_v22_4 (P3.5 U$1.16)
NetIC1_ECVT_12: Microcontroller_sch_v22_0 (IC1_ECVT.12), Microcontroller_sch_v22_1 (IC2_DAQ.12 U1.10), Microcontroller_sch_v22_4 (P3.4 U$1.17)
NetIC1_ECVT_13: Microcontroller_sch_v22_0 (IC1_ECVT.13), Microcontroller_sch_v22_1 (IC2_DAQ.13 U1.14), Microcontroller_sch_v22_2 (J2.C9), Microcontroller_sch_v22_4 (P3.6 U$1.14)
NetIC1_ECVT_14: Microcontroller_sch_v22_0 (IC1_ECVT.14), Microcontroller_sch_v22_1 (IC2_DAQ.14), Microcontroller_sch_v22_3 (R5.1 R12.2)
NetIC1_ECVT_15: Microcontroller_sch_v22_0 (IC1_ECVT.15), Microcontroller_sch_v22_1 (IC2_DAQ.15), Microcontroller_sch_v22_3 (R4.1 R10.2)
NetIC1_ECVT_16: Microcontroller_sch_v22_0 (IC1_ECVT.16), Microcontroller_sch_v22_1 (IC2_DAQ.16), Microcontroller_sch_v22_3 (R6.1 R8.2)
NetIC1_ECVT_17: Microcontroller_sch_v22_0 (IC1_ECVT.17), Microcontroller_sch_v22_1 (IC2_DAQ.17), Microcontroller_sch_v22_3 (R7.1 R9.2)
NetIC1_ECVT_18: Microcontroller_sch_v22_0 (IC1_ECVT.18 R2.1), Microcontroller_sch_v22_1 (IC2_DAQ.18), Microcontroller_sch_v22_2 (J2.A12)
NetIC1_ECVT_19: Microcontroller_sch_v22_0 (IC1_ECVT.19 R1.1), Microcontroller_sch_v22_1 (IC2_DAQ.19), Microcontroller_sch_v22_2 (J2.B1)
NetIC1_ECVT_20: Microcontroller_sch_v22_0 (IC1_ECVT.20), Microcontroller_sch_v22_1 (IC2_DAQ.20), Microcontroller_sch_v22_2 (J2.B6)
NetIC1_ECVT_21: Microcontroller_sch_v22_0 (IC1_ECVT.21), Microcontroller_sch_v22_1 (IC2_DAQ.21), Microcontroller_sch_v22_2 (J2.B7)
NetIC1_ECVT_22: Microcontroller_sch_v22_0 (IC1_ECVT.22), Microcontroller_sch_v22_1 (IC2_DAQ.22), Microcontroller_sch_v22_2 (J2.B8)
NetIC1_ECVT_31: Microcontroller_sch_v22_0 (IC1_ECVT.31), Microcontroller_sch_v22_2 (J2.E9)
NetIC1_ECVT_32: Microcontroller_sch_v22_0 (IC1_ECVT.32), Microcontroller_sch_v22_2 (J2.E10)
NetIC1_ECVT_33: Microcontroller_sch_v22_0 (IC1_ECVT.33), Microcontroller_sch_v22_2 (J2.E11)
NetIC1_ECVT_34: Microcontroller_sch_v22_0 (IC1_ECVT.34), Microcontroller_sch_v22_2 (J2.E12)
NetIC1_ECVT_57: Microcontroller_sch_v22_0 (IC1_ECVT.57), Microcontroller_sch_v22_1 (IC2_DAQ.1), Microcontroller_sch_v22_2 (J2.A11)
NetIC2_DAQ_38: Microcontroller_sch_v22_1 (IC2_DAQ.38), Microcontroller_sch_v22_2 (J2.B12)
NetIC2_DAQ_40: Microcontroller_sch_v22_1 (IC2_DAQ.40), Microcontroller_sch_v22_3 (R3.1 R11.2)
NetIC2_DAQ_41: Microcontroller_sch_v22_1 (IC2_DAQ.41), Microcontroller_sch_v22_2 (J2.B9)
NetIC2_DAQ_57: Microcontroller_sch_v22_1 (IC2_DAQ.57), Microcontroller_sch_v22_2 (J2.A10)
NetJ2_B2: Microcontroller_sch_v22_2 (J2.B2), Microcontroller_sch_v22_3 (R5.2)
NetJ2_B3: Microcontroller_sch_v22_2 (J2.B3), Microcontroller_sch_v22_3 (R4.2)
NetJ2_B4: Microcontroller_sch_v22_2 (J2.B4), Microcontroller_sch_v22_3 (R6.2)
NetJ2_B5: Microcontroller_sch_v22_2 (J2.B5), Microcontroller_sch_v22_3 (R7.2)
NetJ2_B10: Microcontroller_sch_v22_2 (J2.B10), Microcontroller_sch_v22_3 (R3.2)
NetJ2_C1: Microcontroller_sch_v22_0 (U3.2), Microcontroller_sch_v22_2 (J2.C1)
NetJ2_C2: Microcontroller_sch_v22_0 (U3.1), Microcontroller_sch_v22_2 (J2.C2)
NetJ2_C3: Microcontroller_sch_v22_0 (U3.6), Microcontroller_sch_v22_2 (J2.C3)
NetJ2_C4: Microcontroller_sch_v22_0 (U3.7), Microcontroller_sch_v22_2 (J2.C4)
NetJ2_C5: Microcontroller_sch_v22_0 (U3.14), Microcontroller_sch_v22_2 (J2.C5)
NetJ2_C6: Microcontroller_sch_v22_0 (U3.15), Microcontroller_sch_v22_2 (J2.C6)
NetJ2_C7: Microcontroller_sch_v22_0 (U3.9), Microcontroller_sch_v22_2 (J2.C7)
NetJ2_C8: Microcontroller_sch_v22_0 (U3.10), Microcontroller_sch_v22_2 (J2.C8)
NetJ2_C10: Microcontroller_sch_v22_2 (J2.C10), Microcontroller_sch_v22_4 (P1.2 P2.2 R13.2 U2.7)
NetJ2_C11: Microcontroller_sch_v22_2 (J2.C11), Microcontroller_sch_v22_4 (P1.1 P2.1 P4.2 U2.6)